# EAGLE design amp test (EAGLE 9.1.0)
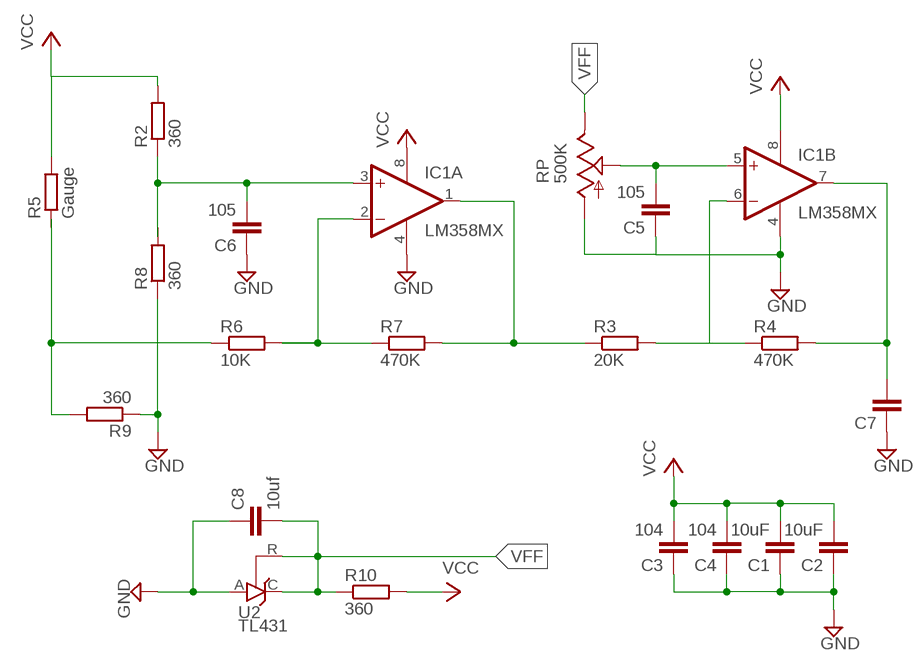
[diagram p0: schematic, sheet 1]

## Parts
C1  10uF  C-EUC0805  [C0805]
C2  10uF  C-EUC0805  [C0805]
C3  104  C-EUC0805  [C0805]
C4  104  C-EUC0805  [C0805]
C5  105  C-EUC0805  [C0805]
C6  105  C-EUC0805  [C0805]
C7  C-EUC0805  [C0805]
C8  10uf  C-EUC0805  [C0805]
IC1  LM358MX  [SO08]
IC2  LM358D  [SO08]
R2  360  R-EU_M0805  [M0805]
R3  20K  R-EU_M0805  [M0805]
R4  470K  R-EU_M0805  [M0805]
R5  Gauge  R-EU_M0805  [M0805]
R6  10K  R-EU_M0805  [M0805]
R7  470K  R-EU_M0805  [M0805]
R8  360  R-EU_M0805  [M0805]
R9  360  R-EU_M0805  [M0805]
R10  360  R-EU_M0805  [M0805]
RP  500K  TRIM_US-B64Y  [B64Y]
U2  TL431  TL431CLP  [TO92-CLP]

## Nets
GND: C1.1 C2.1 C3.1 C4.1 C5.1 C6.1 C7.1 C8.1 IC1.4(P:V-) R8.1 R9.1 RP.A U2.A
N$1: IC1.1(A:OUT) R3.1 R7.2
N$2: C5.2 IC1.5(B:+IN) RP.S
N$3: IC1.6(B:-IN) R3.2 R4.1
N$4: C7.2 IC1.7(B:OUT) R4.2
N$5: C6.2 IC1.3(A:+IN) R2.1 R8.2
N$6: IC1.2(A:-IN) R6.2 R7.1
N$8: R2.2 R5.2 ; supply symbol labelled VCC
N$9: R5.1 R6.1 R9.2
VCC: C1.2 C2.2 C3.2 C4.2 IC1.8(P:V+) R10.2
VFF: C8.2 R10.1 RP.E U2.C U2.R
Unconnected: IC2.1(A:OUT) IC2.2(A:-IN) IC2.3(A:+IN) IC2.5(B:+IN) IC2.6(B:-IN) IC2.7(B:OUT)

## Power pins joined to a net without a drawn wire
V+: IC2.8(P:V+)
V-: IC2.4(P:V-)

## Library data of the parts
C1-C8 = rcl:C-EU: CAPACITOR, European symbol; SPICEPREFIX: C
IC1 IC2 = linear:LM358: OP AMP also LM158; LM258; LM2904 Source: http://cache.national.com/ds/LM/LM158.pdf
R2-R10 = rcl:R-EU_: RESISTOR, European symbol; SPICEPREFIX: R
RP = pot:TRIM_US-: POTENTIOMETER; SPICEPREFIX: J
U2 = v-reg:TL431CLP: VOLTAGE REGULATOR

## Board
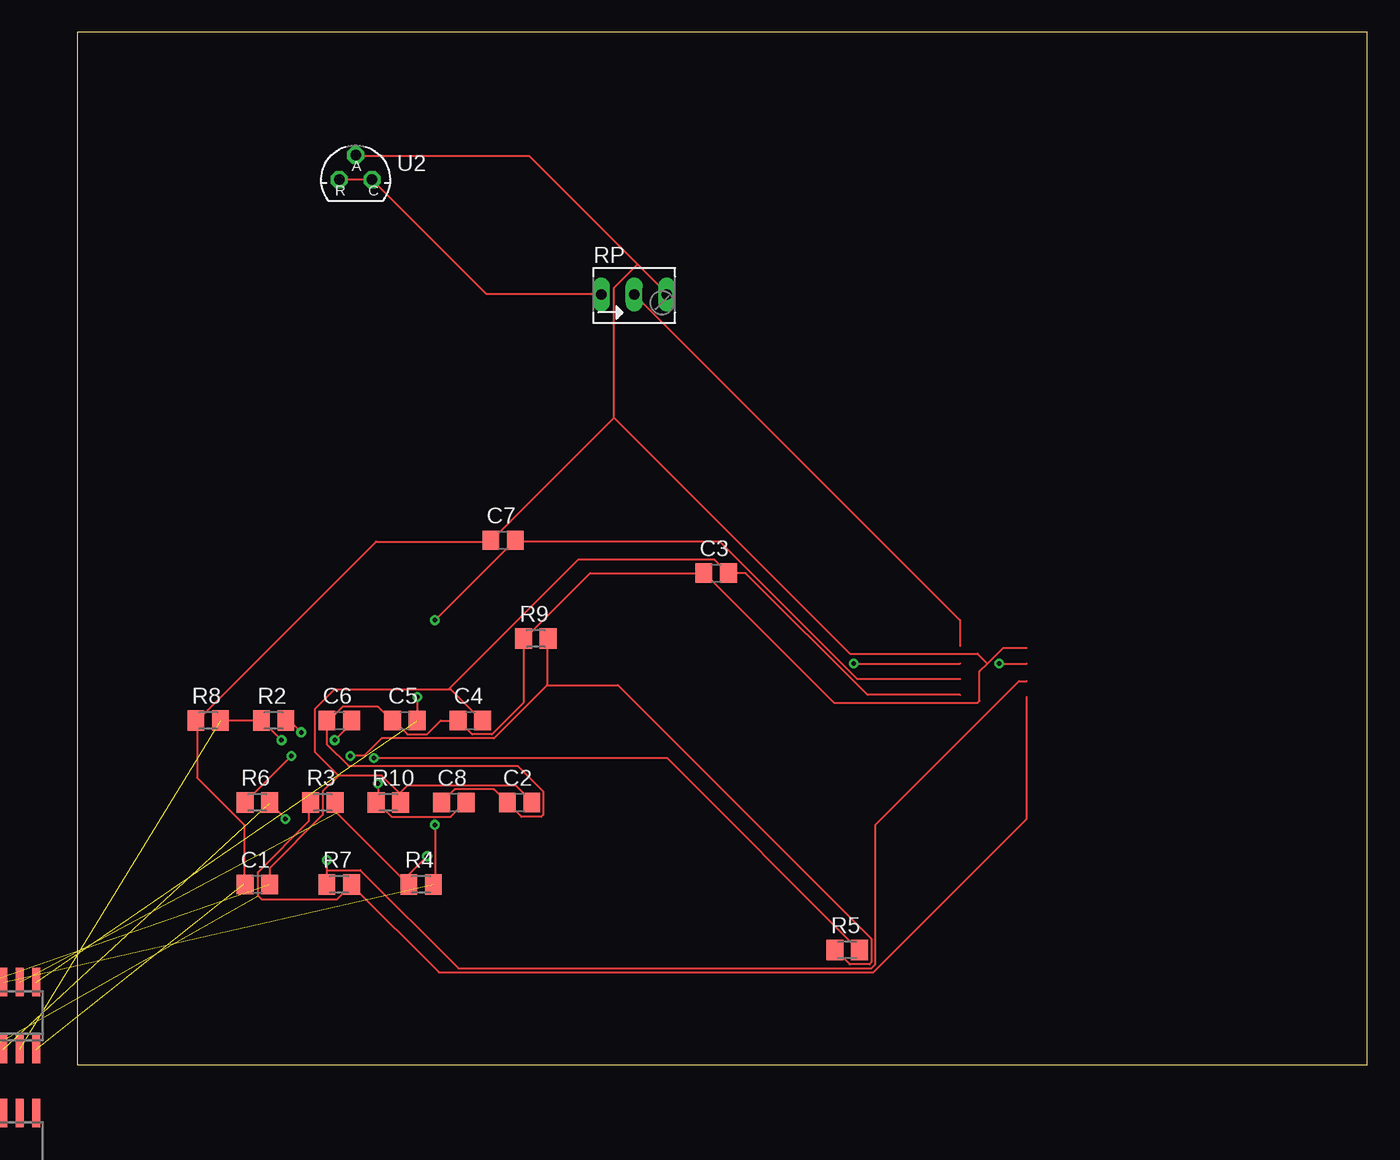
[diagram p1: board, top side]
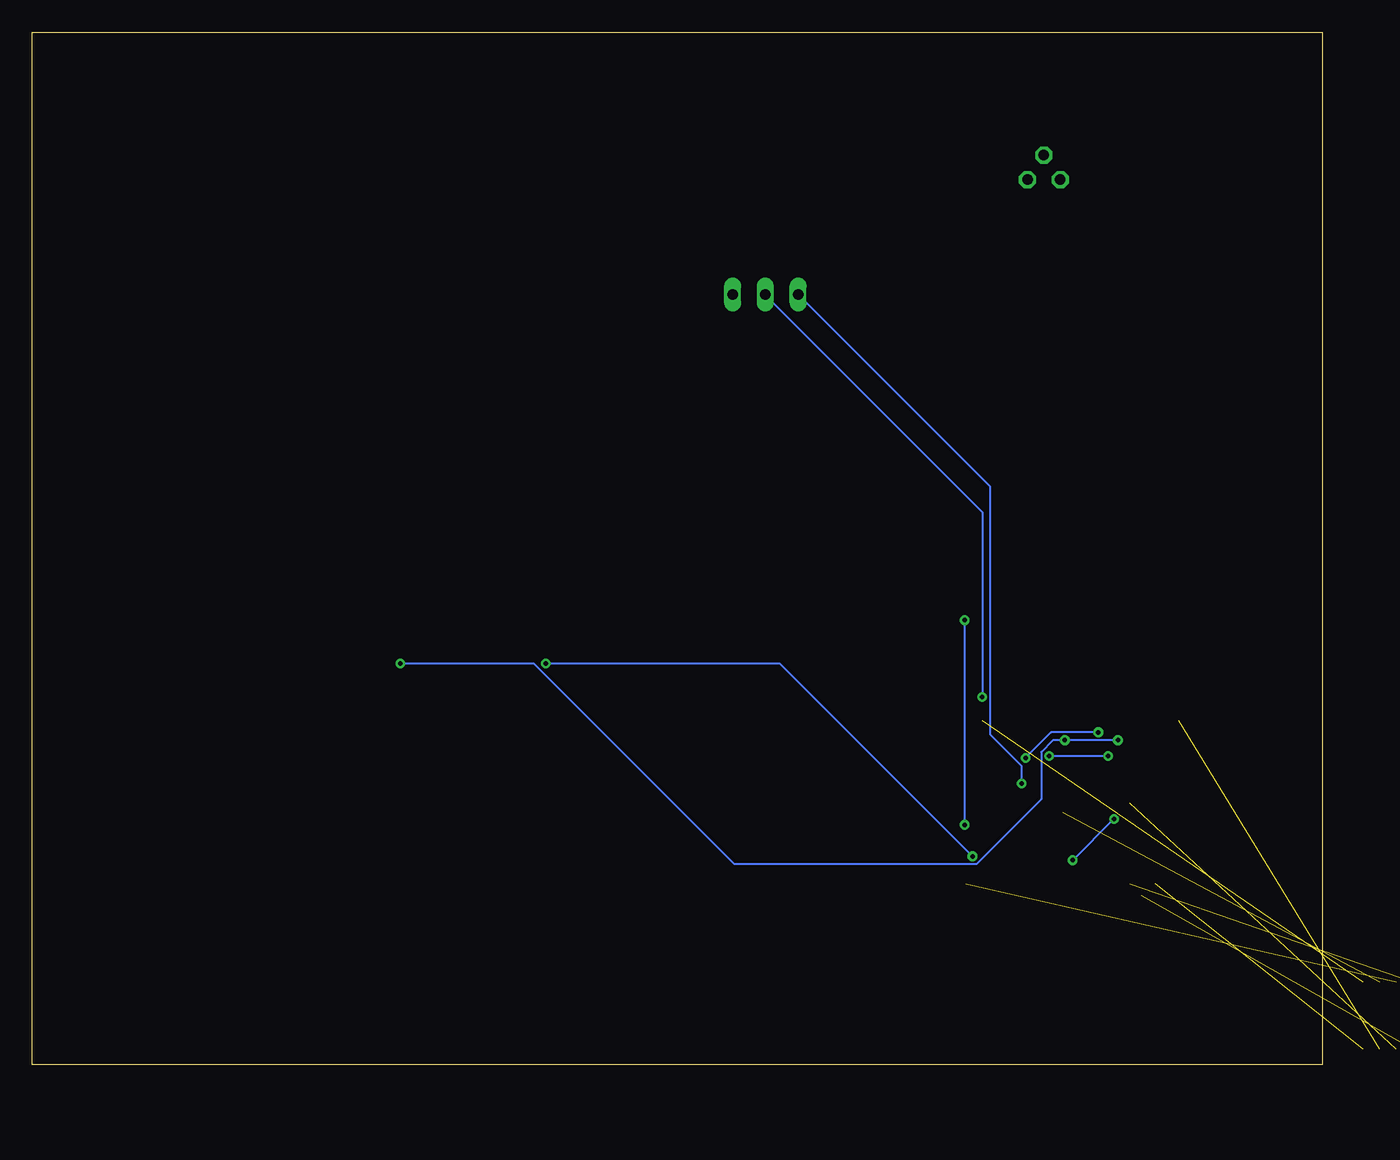
[diagram p2: board, bottom side, seen from below]

Size 100 x 80 mm. Coordinates in mm from the lower left corner, seen from the top.
Outline: 0,0 100,0 100,80 0,80 0,0
Copper layers (1*16): Top 0.035mm / dielectric 1.5mm / Bottom 0.035mm
Design rules "default": minimum track width 6mil, minimum drill 0.35mm, track to track 6mil, track to pad 6mil, pad to pad 6mil, via to via 6mil, smd to smd 6mil, copper to edge 40mil, drill to drill 6mil, minimum pad ring 10mil, minimum via ring 8mil, stop-mask expansion 4mil, vias tented up to drill 0mil, thermal gap 10mil

### Footprints (pad centres in the part's own frame; a part is rotated, then mirrored left to right if it is on the bottom)
C0805 = smd 1.3 x 1.5: 1 -0.95,0; 2 0.95,0
SO08 = smd 0.6 x 2.2: 1 -1.905,-2.6; 2 -0.635,-2.6; 3 0.635,-2.6; 4 1.905,-2.6; 5 1.905,2.6; 6 0.635,2.6; 7 -0.635,2.6; 8 -1.905,2.6
M0805 = smd 1.3 x 1.6: 1 -0.95,0; 2 0.95,0
B64Y = drill 0.813 long: A 2.54,0; E -2.54,0; S 0,0
TO92-CLP = drill 0.813 octagon: A 0,1.905; C 1.27,0; R -1.27,0

### Placement (x,y rotation side)
C1  13.97,13.97 0 top
C2  34.29,20.32 0 top
C3  49.53,38.1 0 top
C4  30.48,26.67 0 top
C5  25.4,26.67 0 top
C6  20.32,26.67 0 top
C7  33.02,40.64 0 top
C8  29.21,20.32 0 top
IC1  -5.08,3.81 0 top  (outside the outline)
IC2  -5.08,-6.35 0 top  (outside the outline)
R2  15.24,26.67 0 top
R3  19.05,20.32 0 top
R4  26.67,13.97 0 top
R5  59.69,8.89 0 top
R6  13.97,20.32 0 top
R7  20.32,13.97 0 top
R8  10.16,26.67 0 top
R9  35.56,33.02 0 top
R10  24.13,20.32 0 top
RP  43.18,59.69 0 top
U2  21.59,68.58 0 top

### Tracks (layer width: path | path; a pad name or v marks a point on that pad's centre or on a via)
GND  (1 unrouted)
  Top 0.152: C8.1 28.35,20.42 29.26,21.34 32.31,21.34 33.22,20.42 C2.1 33.38,20.27 34.44,19.2 35.97,19.2 36.12,19.36 36.12,21.18 34.14,23.16 21.03,23.16 19.36,24.84 19.36,26.67 C6.1 19.51,26.67 20.57,27.74 23.32,27.74 24.38,26.67 C5.1 24.54,26.67 25.6,25.6 27.13,25.6 28.19,26.67 29.41,26.67 C4.1 29.57,26.67 30.63,25.6 32.16,25.6 34.59,28.04 34.59,32.92 R9.1 34.75,33.07 39.78,38.1 48.46,38.1 C3.1 48.62,38.1 58.67,28.04 69.8,28.04 69.95,28.19 69.95,30.48 70.56,31.09 | 73.61,32.31 71.78,32.31 70.56,31.09 | 43.43,62.03 45.72,59.74 RP.A | 43.43,62.03 35.05,70.41 21.64,70.41 U2.A | 9.3,26.67 9.3,22.25 12.95,18.59 12.95,14.02 C1.1 | 9.3,26.67 R8.1 9.3,26.67 | 9.3,26.67 23.16,40.54 32,40.54 C7.1 32.16,40.69 41.6,50.14 | 43.43,62.03 41.6,60.2 41.6,50.14 | 70.56,31.09 69.8,31.85 59.89,31.85 41.6,50.14
N$1  (1 unrouted)
  Top 0.152: R3.1 17.98,20.27 17.98,18.9 14.02,14.94 14.02,13.11 14.33,12.8 20.12,12.8 21.18,13.87 R7.2 21.34,13.87 28.04,7.16 61.72,7.16 73.61,19.05 73.61,28.5
N$2  (via drill 0.35)  (1 unrouted)
  Top 0.152: v26.36,28.5 26.36,26.67 C5.2 | 68.43,32.46 68.43,34.44 43.28,59.59 RP.S
  Bottom 0.152: v26.36,28.5 26.36,42.82 43.13,59.59 RP.S
N$3  (via drill 0.35)  (1 unrouted)
  Top 0.152: 25.3,14.33 25.6,14.02 R4.1 25.3,14.33 | 25.3,14.33 20.12,19.51 20.12,20.27 R3.2 | v60.2,31.09 68.43,31.09 | 25.3,14.33 v27.13,16.15
  Bottom 0.152: v60.2,31.09 42.06,31.09 v27.13,16.15
N$4  (via drill 0.35)  (1 unrouted)
  Top 0.152: 68.43,29.87 60.5,29.87 49.84,40.54 33.98,40.54 C7.2 33.83,40.54 v27.74,34.44 | v27.74,18.59 27.74,14.02 R4.2
  Bottom 0.152: v27.74,34.44 v27.74,18.59
N$5  (via drill 0.35)  (1 unrouted)
  Top 0.152: v19.96,25.15 21.18,26.36 21.18,26.67 C6.2 | v15.85,25.15 14.33,26.67 R2.1 14.17,26.67 11.12,26.67 R8.2 | v71.48,31.09 73.61,31.09
  Bottom 0.152: v15.85,25.15 v19.96,25.15 20.88,25.15 21.79,24.23 21.79,20.57 26.82,15.54 45.57,15.54 61.11,31.09 v71.48,31.09
N$6  (via drill 0.35)  (1 unrouted)
  Top 0.152: v19.36,15.85 19.36,15.09 | 19.36,15.09 19.36,14.02 R7.1 | v16.15,19.05 14.94,20.27 R6.2 | 73.61,29.72 73,29.72 61.87,18.59 61.87,7.77 61.57,7.47 29.57,7.47 21.95,15.09 19.36,15.09
  Bottom 0.152: v16.15,19.05 v19.36,15.85
N$8  (via drill 0.35)
  Top 0.152: v23.01,23.77 45.72,23.77 60.5,8.99 R5.2 | v17.37,25.76 16.46,26.67 16.31,26.67 R2.2
  Bottom 0.152: v23.01,23.77 21.03,25.76 v17.37,25.76
N$9  (via drill 0.35)
  Top 0.152: v16.61,23.93 13.11,20.42 R6.1 | v21.18,23.93 22.25,23.93 23.62,25.3 32.31,25.3 36.42,29.41 | 36.42,29.41 36.42,32.92 R9.2 | 36.42,29.41 41.91,29.41 61.57,9.75 61.57,7.92 61.42,7.77 59.89,7.77 58.83,8.84 R5.1
  Bottom 0.152: v21.18,23.93 v16.61,23.93
VCC  (1 unrouted)
  Top 0.152: 68.43,28.65 61.27,28.65 51.82,38.1 50.6,38.1 C3.2 50.44,38.1 49.38,39.17 38.86,39.17 28.8,29.11 | 20.27,22.4 19.05,21.18 19.05,19.36 14.94,15.24 14.94,14.02 C1.2 | 20.27,22.4 23.62,22.4 24.99,21.03 | 24.99,21.03 24.99,20.42 R10.2 24.99,21.03 | 24.99,21.03 25.6,21.64 33.98,21.64 35.2,20.42 C2.2 | 28.8,29.11 19.96,29.11 18.44,27.58 18.44,24.23 20.27,22.4 | 28.8,29.11 28.96,29.11 31.39,26.67 C4.2
VFF  (via drill 0.35)
  Top 0.152: C8.2 30.02,20.27 28.96,19.2 24.38,19.2 23.32,20.27 R10.1 23.32,20.42 v23.32,21.79 | U2.R 20.42,68.58 U2.C 31.7,59.74 40.54,59.74 RP.E
  Bottom 0.152: v23.32,21.79 23.32,23.16 25.76,25.6 25.76,44.81 40.54,59.59 RP.E